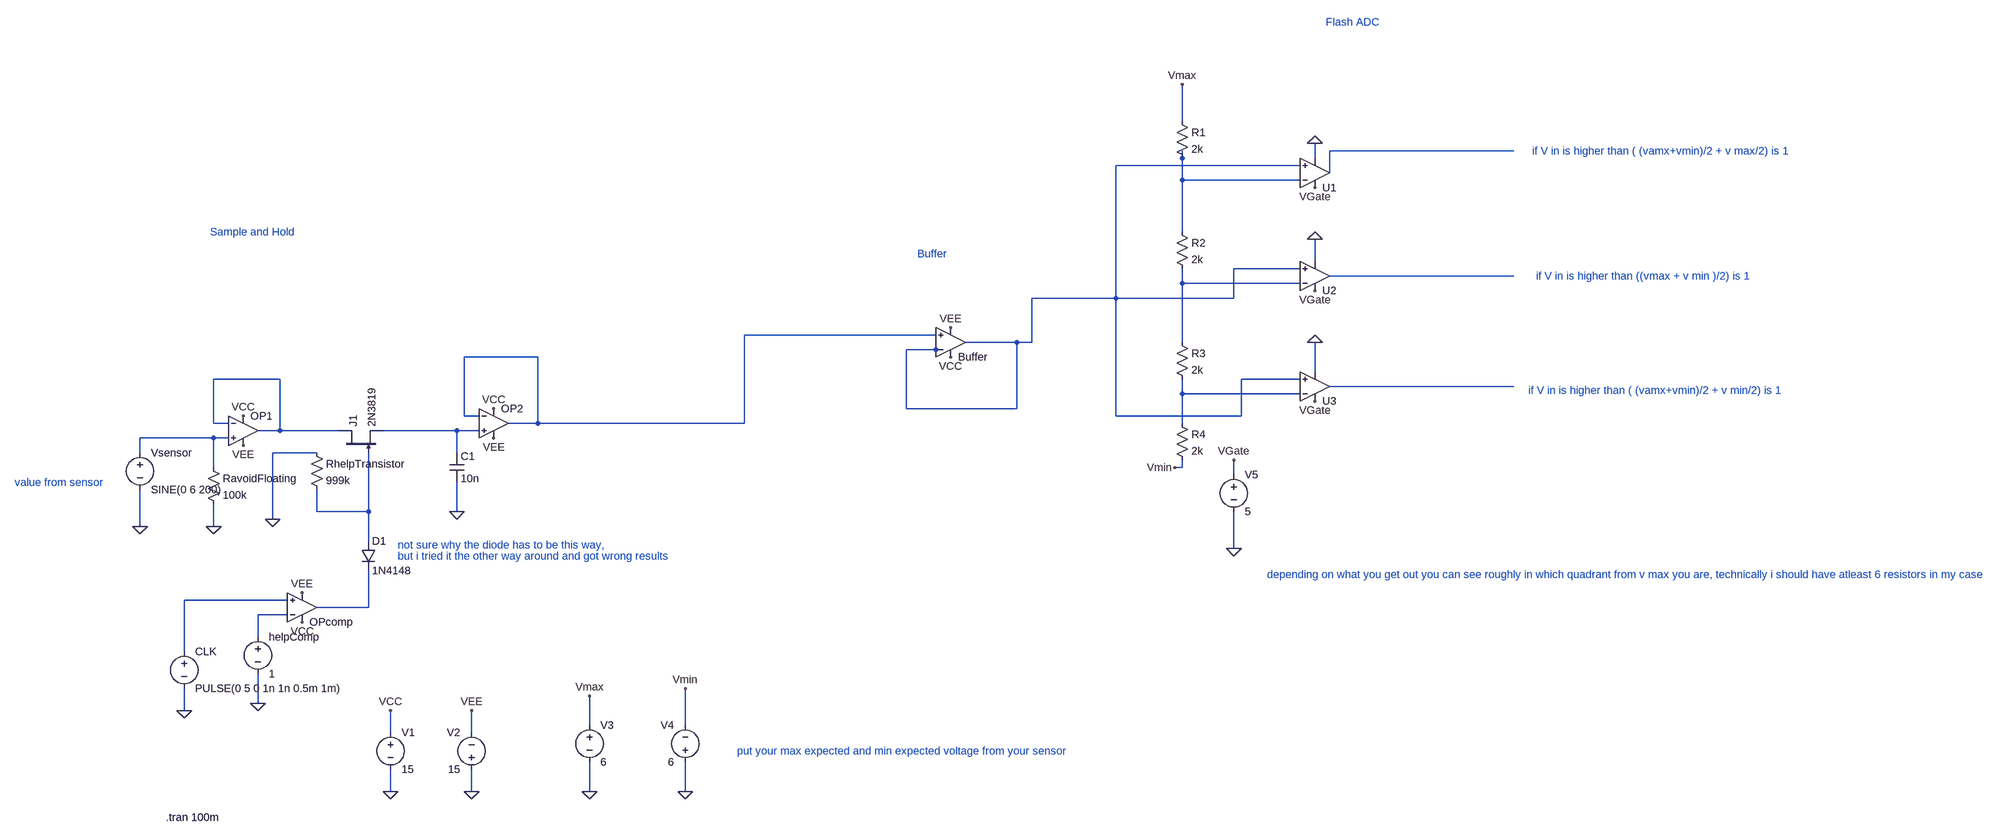
[diagram p0: schematic GeorgiADC.asc]
GeorgiADC.asc, the LTspice schematic file:
Version 4
SHEET 1 4280 680
WIRE 2400 -992 2400 -1072
WIRE 3120 -928 2720 -928
WIRE 2400 -912 2400 -928
WIRE 2688 -912 2688 -944
WIRE 2656 -896 2256 -896
WIRE 2720 -880 2720 -928
WIRE 2400 -864 2400 -912
WIRE 2656 -864 2400 -864
WIRE 2400 -752 2400 -864
WIRE 2688 -688 2688 -736
WIRE 2656 -672 2512 -672
WIRE 3120 -656 2720 -656
WIRE 2400 -640 2400 -672
WIRE 2656 -640 2400 -640
WIRE 2256 -608 2256 -896
WIRE 2256 -608 1888 -608
WIRE 2512 -608 2512 -672
WIRE 2512 -608 2256 -608
WIRE 1680 -528 1264 -528
WIRE 1856 -512 1744 -512
WIRE 1888 -512 1888 -608
WIRE 1888 -512 1856 -512
WIRE 2400 -512 2400 -640
WIRE 1680 -496 1616 -496
WIRE 1696 -496 1680 -496
WIRE 816 -480 656 -480
WIRE 2688 -448 2688 -512
WIRE 256 -432 112 -432
WIRE 2656 -432 2528 -432
WIRE 3120 -416 2720 -416
WIRE 2400 -400 2400 -432
WIRE 2656 -400 2400 -400
WIRE 1616 -368 1616 -496
WIRE 1856 -368 1856 -512
WIRE 1856 -368 1616 -368
WIRE 656 -352 656 -480
WIRE 688 -352 656 -352
WIRE 2256 -352 2256 -608
WIRE 2528 -352 2528 -432
WIRE 2528 -352 2256 -352
WIRE 112 -336 112 -432
WIRE 144 -336 112 -336
WIRE 816 -336 816 -480
WIRE 816 -336 752 -336
WIRE 1264 -336 1264 -528
WIRE 1264 -336 816 -336
WIRE 2400 -336 2400 -400
WIRE 256 -320 256 -432
WIRE 256 -320 208 -320
WIRE 384 -320 256 -320
WIRE 640 -320 480 -320
WIRE 688 -320 640 -320
WIRE 112 -304 -48 -304
WIRE 144 -304 112 -304
WIRE -48 -272 -48 -304
WIRE 336 -272 240 -272
WIRE 640 -272 640 -320
WIRE 112 -240 112 -304
WIRE 2400 -240 2400 -256
WIRE 2400 -240 2384 -240
WIRE 2512 -224 2512 -256
WIRE 336 -144 336 -192
WIRE 448 -144 448 -272
WIRE 448 -144 336 -144
WIRE 640 -144 640 -208
WIRE 240 -128 240 -272
WIRE -48 -112 -48 -192
WIRE 112 -112 112 -160
WIRE 448 -80 448 -144
WIRE 2512 -64 2512 -144
WIRE 272 48 48 48
WIRE 448 64 448 -16
WIRE 448 64 336 64
WIRE 272 80 208 80
WIRE 208 128 208 80
WIRE 48 160 48 48
WIRE 208 272 208 208
WIRE 48 288 48 240
WIRE 928 320 928 256
WIRE 1136 320 1136 240
WIRE 496 336 496 288
WIRE 672 336 672 288
WIRE 496 464 496 416
WIRE 672 464 672 416
WIRE 928 464 928 400
WIRE 1136 464 1136 400
FLAG 48 288 0
FLAG 304 96 VCC
FLAG 304 32 VEE
FLAG 208 272 0
FLAG 496 288 VCC
FLAG 672 288 VEE
FLAG 496 464 0
FLAG 672 464 0
FLAG -48 -112 0
FLAG 112 -112 0
FLAG 176 -352 VCC
FLAG 176 -288 VEE
FLAG 720 -368 VCC
FLAG 720 -304 VEE
FLAG 640 -144 0
FLAG 240 -128 0
FLAG 928 464 0
FLAG 928 256 Vmax
FLAG 2400 -1072 Vmax
FLAG 1136 464 0
FLAG 1136 240 Vmin
FLAG 2384 -240 Vmin
FLAG 2512 -64 0
FLAG 2512 -256 VGate
FLAG 2688 -944 0
FLAG 2688 -736 0
FLAG 2688 -512 0
FLAG 2688 -848 VGate
FLAG 2688 -624 VGate
FLAG 2688 -384 VGate
FLAG 1712 -480 VCC
FLAG 1712 -544 VEE
SYMBOL voltage 48 144 R0
WINDOW 123 0 0 Left 0
WINDOW 39 0 0 Left 0
SYMATTR InstName CLK
SYMATTR Value PULSE(0 5 0 1n 1n 0.5m 1m)
SYMBOL voltage 208 112 R0
SYMATTR InstName helpComp
SYMATTR Value 1
SYMBOL voltage 496 320 R0
SYMATTR InstName V1
SYMATTR Value 15
SYMBOL voltage 672 432 R180
WINDOW 0 24 96 Left 2
WINDOW 3 24 16 Left 2
SYMATTR InstName V2
SYMATTR Value 15
SYMBOL OpAmps\\UniversalOpAmp2 304 64 M180
SYMATTR InstName OPcomp
SYMBOL voltage -48 -288 R0
WINDOW 123 0 0 Left 0
WINDOW 39 0 0 Left 0
SYMATTR InstName Vsensor
SYMATTR Value SINE(0 6 200)
SYMBOL OpAmps\\UniversalOpAmp2 176 -320 R0
SYMATTR InstName OP1
SYMBOL res 96 -256 R0
SYMATTR InstName RavoidFloating
SYMATTR Value 100k
SYMBOL njf 384 -272 R270
SYMATTR InstName J1
SYMATTR Value 2N3819
SYMBOL res 320 -288 R0
SYMATTR InstName RhelpTransistor
SYMATTR Value 999k
SYMBOL diode 432 -80 R0
SYMATTR InstName D1
SYMATTR Value 1N4148
SYMBOL OpAmps\\UniversalOpAmp2 720 -336 R0
SYMATTR InstName OP2
SYMBOL cap 624 -272 R0
SYMATTR InstName C1
SYMATTR Value 10n
SYMBOL voltage 928 304 R0
WINDOW 123 0 0 Left 0
WINDOW 39 0 0 Left 0
SYMATTR InstName V3
SYMATTR Value 6
SYMBOL voltage 1136 416 R180
WINDOW 0 24 96 Left 2
WINDOW 3 24 16 Left 2
WINDOW 123 0 0 Left 0
WINDOW 39 0 0 Left 0
SYMATTR InstName V4
SYMATTR Value 6
SYMBOL res 2384 -1008 R0
SYMATTR InstName R1
SYMATTR Value 2k
SYMBOL res 2384 -768 R0
SYMATTR InstName R2
SYMATTR Value 2k
SYMBOL res 2384 -528 R0
SYMATTR InstName R3
SYMATTR Value 2k
SYMBOL OpAmps\\UniversalOpAmp2 2688 -880 M180
SYMATTR InstName U1
SYMBOL OpAmps\\UniversalOpAmp2 2688 -656 M180
SYMATTR InstName U2
SYMBOL OpAmps\\UniversalOpAmp2 2688 -416 M180
SYMATTR InstName U3
SYMBOL voltage 2512 -240 R0
SYMATTR InstName V5
SYMATTR Value 5
SYMBOL res 2384 -352 R0
SYMATTR InstName R4
SYMATTR Value 2k
SYMBOL OpAmps\\UniversalOpAmp2 1712 -512 M180
SYMATTR InstName Buffer
TEXT 8 520 Left 2 !.tran 100m
TEXT 512 -72 Left 2 ;not sure why the diode has to be this way,
TEXT 512 -48 Left 2 ;but i tried it the other way around and got wrong results
TEXT -320 -208 Left 2 ;value from sensor
TEXT 1248 376 Left 2 ;put your max expected and min expected voltage from your sensor
TEXT 2584 -8 Left 2 ;depending on what you get out you can see roughly in which quadrant from v max you are, technically i should have atleast 6 resistors in my case
TEXT 104 -752 Left 2 ;Sample and Hold
TEXT 2712 -1208 Left 2 ;Flash ADC
TEXT 1640 -704 Left 2 ;Buffer
TEXT 3152 -408 Left 2 ;if V in is higher than ( (vamx+vmin)/2 + v min/2) is 1
TEXT 3168 -656 Left 2 ;if V in is higher than ((vmax + v min )/2) is 1
TEXT 3160 -928 Left 2 ;if V in is higher than ( (vamx+vmin)/2 + v max/2) is 1

The netlist it stands for:
* GeorgiADC.asc
V§CLK N013 0 PULSE(0 5 0 1n 1n 0.5m 1m)
V§helpComp N015 0 1
V1 VCC 0 15
V2 0 VEE 15
XOPcomp N013 N015 VCC VEE N014 level2 Avol=1Meg GBW=10Meg Slew=10Meg Ilimit=25m Rail=0 Vos=0 En=0 Enk=0 In=0 Ink=0 Rin=500Meg  ; pins In+ In- V+ V- OUT
Vsensor N011 0 SINE(0 6 200)
XOP1 N011 N007 VCC VEE N007 level2 Avol=1Meg GBW=10Meg Slew=10Meg Ilimit=25m Rail=0 Vos=0 En=0 Enk=0 In=0 Ink=0 Rin=500Meg  ; pins In+ In- V+ V- OUT
RavoidFloating N011 0 100k
J1 N007 N012 N010 2N3819
RhelpTransistor 0 N012 999k
D1 N012 N014 1N4148
XOP2 N010 N006 VCC VEE N006 level2 Avol=1Meg GBW=10Meg Slew=10Meg Ilimit=25m Rail=0 Vos=0 En=0 Enk=0 In=0 Ink=0 Rin=500Meg  ; pins In+ In- V+ V- OUT
C1 N010 0 10n
V3 Vmax 0 6
V4 0 Vmin 6
R1 Vmax N002 2k
R2 N002 N005 2k
R3 N005 N009 2k
XU1 N003 N002 VGate 0 N001 level2 Avol=1Meg GBW=10Meg Slew=10Meg Ilimit=25m Rail=0 Vos=0 En=0 Enk=0 In=0 Ink=0 Rin=500Meg  ; pins In+ In- V+ V- OUT
XU2 N003 N005 VGate 0 N004 level2 Avol=1Meg GBW=10Meg Slew=10Meg Ilimit=25m Rail=0 Vos=0 En=0 Enk=0 In=0 Ink=0 Rin=500Meg  ; pins In+ In- V+ V- OUT
XU3 N003 N009 VGate 0 N008 level2 Avol=1Meg GBW=10Meg Slew=10Meg Ilimit=25m Rail=0 Vos=0 En=0 Enk=0 In=0 Ink=0 Rin=500Meg  ; pins In+ In- V+ V- OUT
V5 VGate 0 5
R4 N009 Vmin 2k
XBuffer N006 N003 VCC VEE N003 level2 Avol=1Meg GBW=10Meg Slew=10Meg Ilimit=25m Rail=0 Vos=0 En=0 Enk=0 In=0 Ink=0 Rin=500Meg  ; pins In+ In- V+ V- OUT
.model D D
.lib standard.dio
.model NJF NJF
.model PJF PJF
.lib standard.jft
.tran 100m
* not sure why the diode has to be this way,
* but i tried it the other way around and got wrong results
* value from sensor
* put your max expected and min expected voltage from your sensor
* depending on what you get out you can see roughly in which quadrant from v max you are, technically i should have atleast 6 resistors in my case
* Sample and Hold
* Flash ADC
* Buffer
* if V in is higher than ( (vamx+vmin)/2 + v min/2) is 1
* if V in is higher than ((vmax + v min )/2) is 1
* if V in is higher than ( (vamx+vmin)/2 + v max/2) is 1
.lib UniversalOpAmp2.lib
.backanno
.end